# EAGLE design pcb (EAGLE 9.6.2)
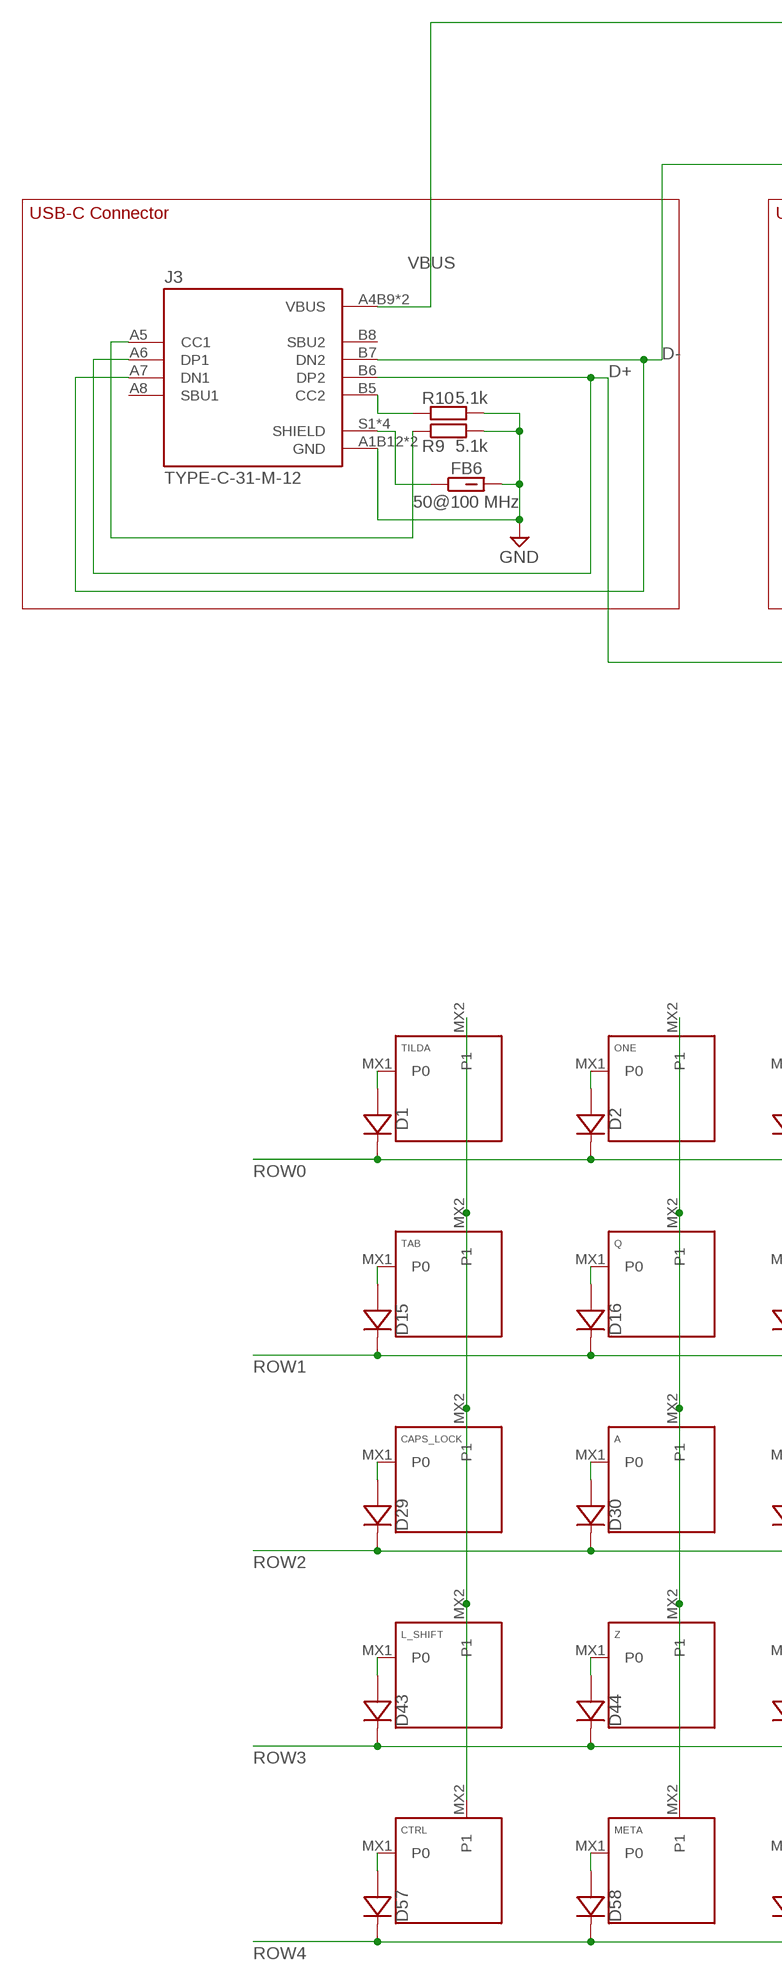
[diagram p0: schematic, sheet 1, part 1 of 2]
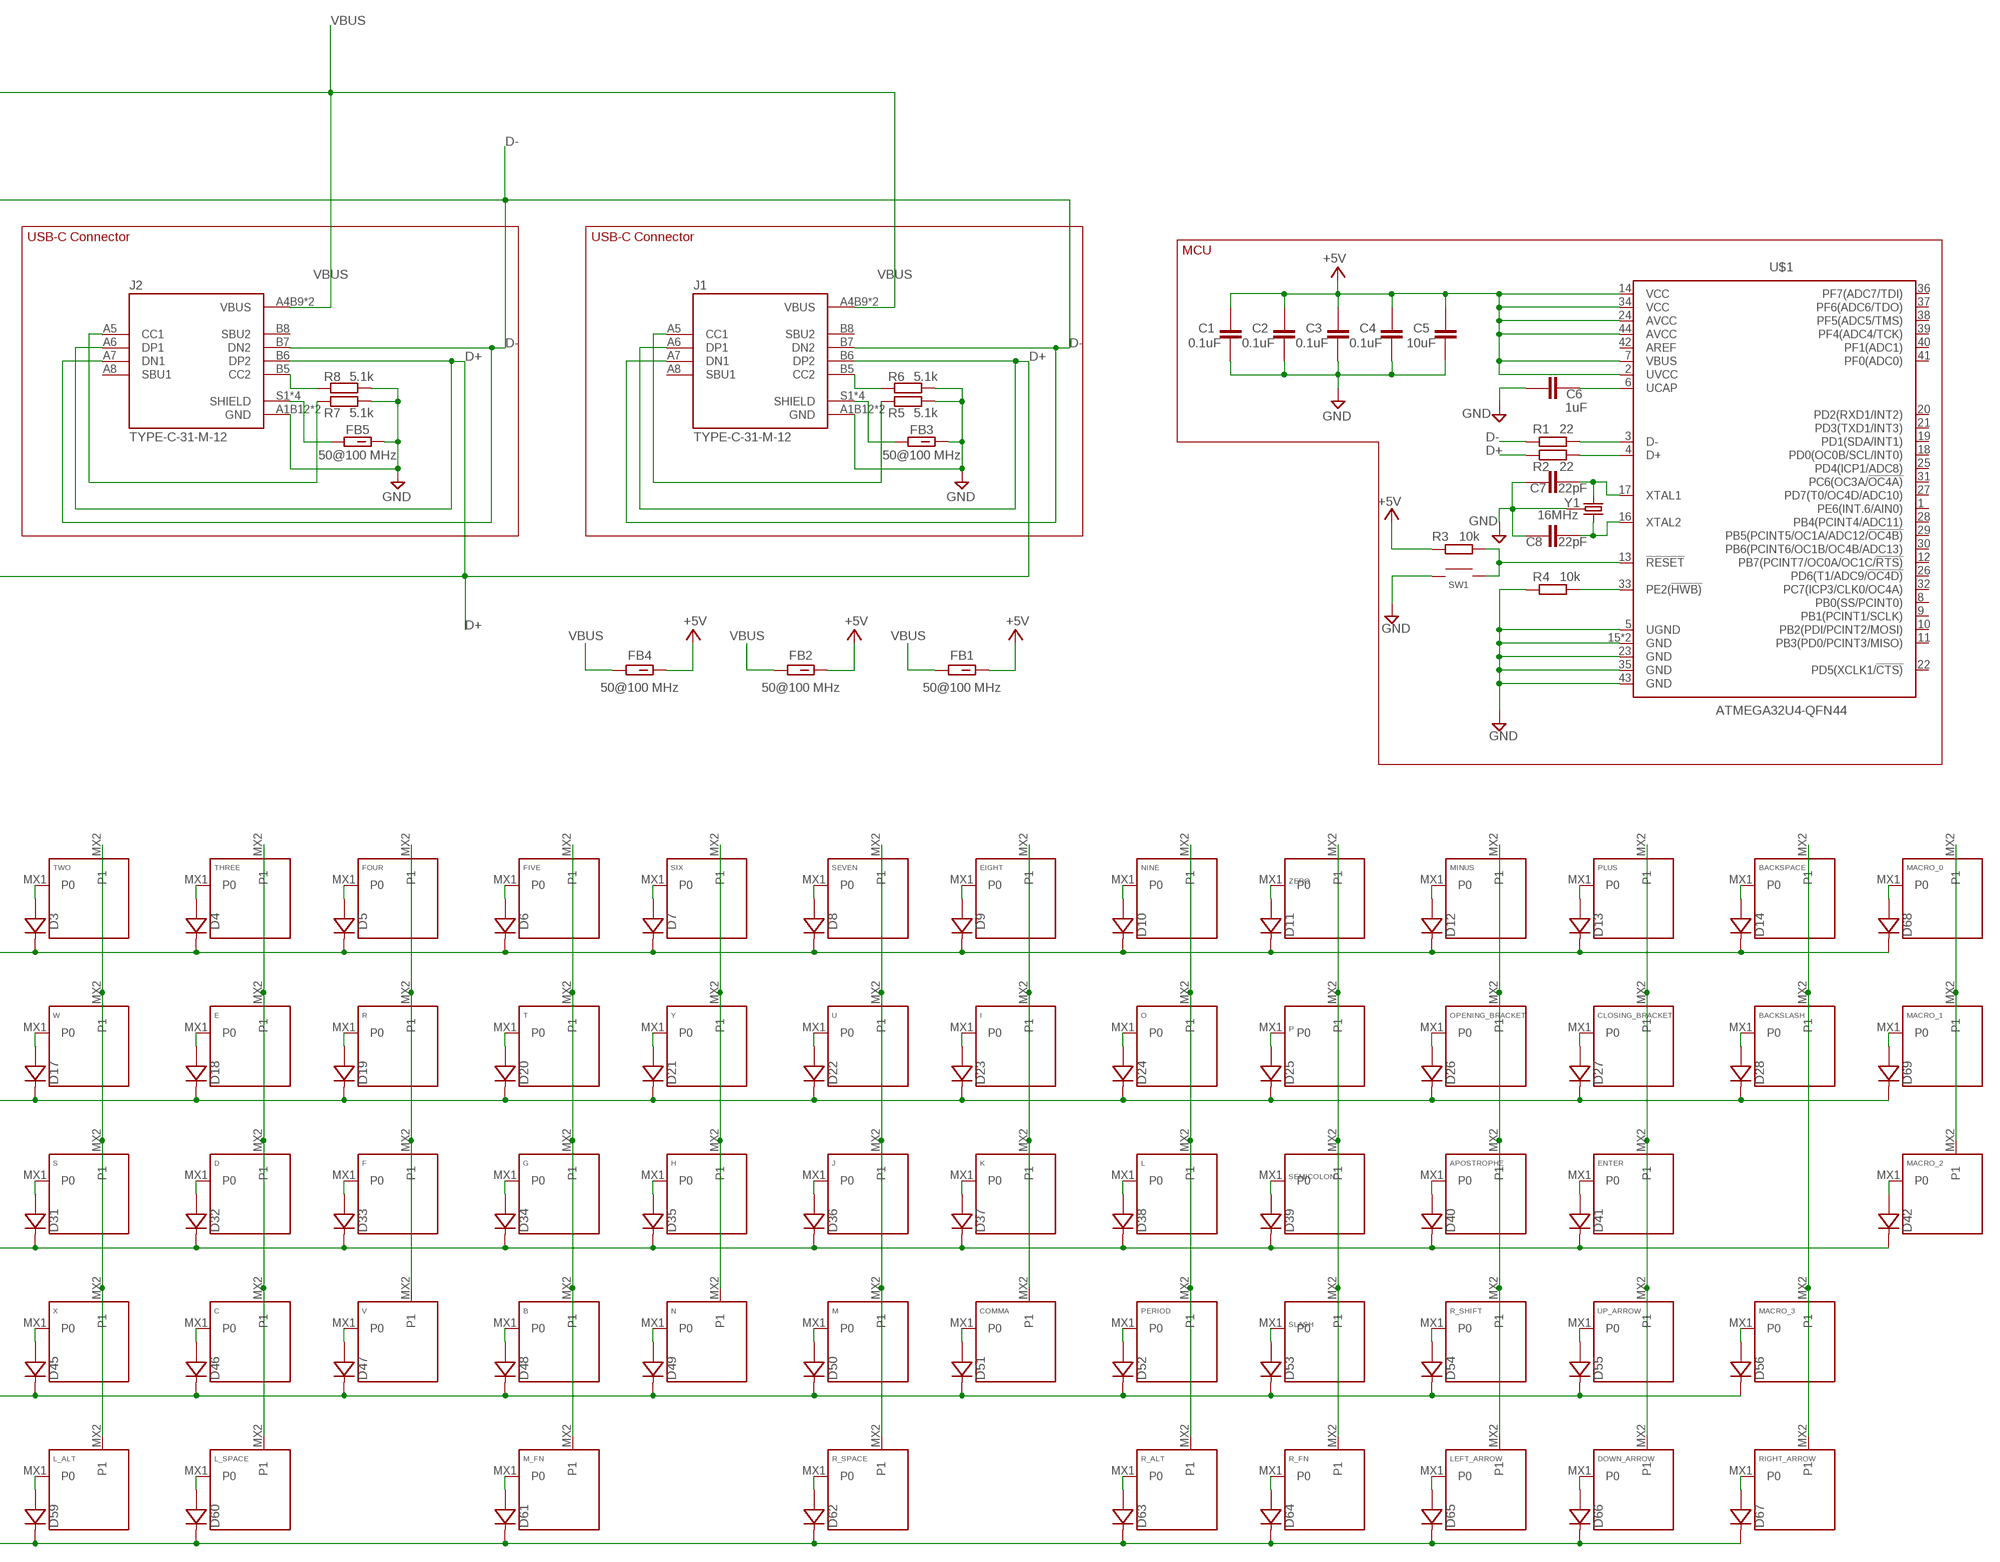
[diagram p1: schematic, sheet 1, part 2 of 2]

## Parts
A  KEYSWITCH-PLAIN-MXHSPCB-1U  [MXHSPCB-1U]
APOSTROPHE  KEYSWITCH-PLAIN-MXHSPCB-1U  [MXHSPCB-1U]
B  KEYSWITCH-PLAIN-MXHSPCB-1U  [MXHSPCB-1U]
BACKSLASH  KEYSWITCH-PLAIN-MXHSPCB-1U  [MXHSPCB-1U]
BACKSPACE  KEYSWITCH-PLAIN-MXHSPCB-2U  [MXHSPCB-2U]
C  KEYSWITCH-PLAIN-MXHSPCB-1U  [MXHSPCB-1U]
C1  0.1uF  CAPACITOR-0603  [C0603]
C2  0.1uF  CAPACITOR-0603  [C0603]
C3  0.1uF  CAPACITOR-0603  [C0603]
C4  0.1uF  CAPACITOR-0603  [C0603]
C5  10uF  CAPACITOR-0603  [C0603]
C6  1uF  CAPACITOR-0603  [C0603]
C7  22pF  CAPACITOR-0603  [C0603]
C8  22pF  CAPACITOR-0603  [C0603]
CAPS_LOCK  KEYSWITCH-PLAIN-MXHSPCB-1U  [MXHSPCB-1U]
CLOSING_BRACKET  KEYSWITCH-PLAIN-MXHSPCB-1U  [MXHSPCB-1U]
COMMA  KEYSWITCH-PLAIN-MXHSPCB-1U  [MXHSPCB-1U]
CTRL  KEYSWITCH-PLAIN-MXHSPCB-1U  [MXHSPCB-1U]
D  KEYSWITCH-PLAIN-MXHSPCB-1U  [MXHSPCB-1U]
D1  DIODE-SOD-123  [SOD-123]
D2  DIODE-SOD-123  [SOD-123]
D3  DIODE-SOD-123  [SOD-123]
D4  DIODE-SOD-123  [SOD-123]
D5  DIODE-SOD-123  [SOD-123]
D6  DIODE-SOD-123  [SOD-123]
D7  DIODE-SOD-123  [SOD-123]
D8  DIODE-SOD-123  [SOD-123]
D9  DIODE-SOD-123  [SOD-123]
D10  DIODE-SOD-123  [SOD-123]
D11  DIODE-SOD-123  [SOD-123]
D12  DIODE-SOD-123  [SOD-123]
D13  DIODE-SOD-123  [SOD-123]
D14  DIODE-SOD-123  [SOD-123]
D15  DIODE-SOD-123  [SOD-123]
D16  DIODE-SOD-123  [SOD-123]
D17  DIODE-SOD-123  [SOD-123]
D18  DIODE-SOD-123  [SOD-123]
D19  DIODE-SOD-123  [SOD-123]
D20  DIODE-SOD-123  [SOD-123]
D21  DIODE-SOD-123  [SOD-123]
D22  DIODE-SOD-123  [SOD-123]
D23  DIODE-SOD-123  [SOD-123]
D24  DIODE-SOD-123  [SOD-123]
D25  DIODE-SOD-123  [SOD-123]
D26  DIODE-SOD-123  [SOD-123]
D27  DIODE-SOD-123  [SOD-123]
D28  DIODE-SOD-123  [SOD-123]
D29  DIODE-SOD-123  [SOD-123]
D30  DIODE-SOD-123  [SOD-123]
D31  DIODE-SOD-123  [SOD-123]
D32  DIODE-SOD-123  [SOD-123]
D33  DIODE-SOD-123  [SOD-123]
D34  DIODE-SOD-123  [SOD-123]
D35  DIODE-SOD-123  [SOD-123]
D36  DIODE-SOD-123  [SOD-123]
D37  DIODE-SOD-123  [SOD-123]
D38  DIODE-SOD-123  [SOD-123]
D39  DIODE-SOD-123  [SOD-123]
D40  DIODE-SOD-123  [SOD-123]
D41  DIODE-SOD-123  [SOD-123]
D42  DIODE-SOD-123  [SOD-123]
D43  DIODE-SOD-123  [SOD-123]
D44  DIODE-SOD-123  [SOD-123]
D45  DIODE-SOD-123  [SOD-123]
D46  DIODE-SOD-123  [SOD-123]
D47  DIODE-SOD-123  [SOD-123]
D48  DIODE-SOD-123  [SOD-123]
D49  DIODE-SOD-123  [SOD-123]
D50  DIODE-SOD-123  [SOD-123]
D51  DIODE-SOD-123  [SOD-123]
D52  DIODE-SOD-123  [SOD-123]
D53  DIODE-SOD-123  [SOD-123]
D54  DIODE-SOD-123  [SOD-123]
D55  DIODE-SOD-123  [SOD-123]
D56  DIODE-SOD-123  [SOD-123]
D57  DIODE-SOD-123  [SOD-123]
D58  DIODE-SOD-123  [SOD-123]
D59  DIODE-SOD-123  [SOD-123]
D60  DIODE-SOD-123  [SOD-123]
D61  DIODE-SOD-123  [SOD-123]
D62  DIODE-SOD-123  [SOD-123]
D63  DIODE-SOD-123  [SOD-123]
D64  DIODE-SOD-123  [SOD-123]
D65  DIODE-SOD-123  [SOD-123]
D66  DIODE-SOD-123  [SOD-123]
D67  DIODE-SOD-123  [SOD-123]
D68  DIODE-SOD-123  [SOD-123]
D69  DIODE-SOD-123  [SOD-123]
DOWN_ARROW  KEYSWITCH-PLAIN-MXHSPCB-1U  [MXHSPCB-1U]
E  KEYSWITCH-PLAIN-MXHSPCB-1U  [MXHSPCB-1U]
EIGHT  KEYSWITCH-PLAIN-MXHSPCB-1U  [MXHSPCB-1U]
ENTER  KEYSWITCH-PLAIN-MXHSPCB-2U  [MXHSPCB-2U]
F  KEYSWITCH-PLAIN-MXHSPCB-1U  [MXHSPCB-1U]
FB1  50@100 MHz  FBCHIP-0603(1608-METRIC)  [BEADC1608X95N]
FB2  50@100 MHz  FBCHIP-0603(1608-METRIC)  [BEADC1608X95N]
FB3  50@100 MHz  FBCHIP-0603(1608-METRIC)  [BEADC1608X95N]
FB4  50@100 MHz  FBCHIP-0603(1608-METRIC)  [BEADC1608X95N]
FB5  50@100 MHz  FBCHIP-0603(1608-METRIC)  [BEADC1608X95N]
FB6  50@100 MHz  FBCHIP-0603(1608-METRIC)  [BEADC1608X95N]
FIVE  KEYSWITCH-PLAIN-MXHSPCB-1U  [MXHSPCB-1U]
FOUR  KEYSWITCH-PLAIN-MXHSPCB-1U  [MXHSPCB-1U]
G  KEYSWITCH-PLAIN-MXHSPCB-1U  [MXHSPCB-1U]
H  KEYSWITCH-PLAIN-MXHSPCB-1U  [MXHSPCB-1U]
I  KEYSWITCH-PLAIN-MXHSPCB-1U  [MXHSPCB-1U]
J  KEYSWITCH-PLAIN-MXHSPCB-1U  [MXHSPCB-1U]
J1  TYPE-C-31-M-12  [HRO_TYPE-C-31-M-12]
J2  TYPE-C-31-M-12  [HRO_TYPE-C-31-M-12]
J3  TYPE-C-31-M-12  [HRO_TYPE-C-31-M-12]
K  KEYSWITCH-PLAIN-MXHSPCB-1U  [MXHSPCB-1U]
L  KEYSWITCH-PLAIN-MXHSPCB-1U  [MXHSPCB-1U]
L_ALT  KEYSWITCH-PLAIN-MXHSPCB-1U  [MXHSPCB-1U]
L_SHIFT  KEYSWITCH-PLAIN-MXHSPCB-2U  [MXHSPCB-2U]
L_SPACE  KEYSWITCH-PLAIN-MXHSPCB-2U-FLIPPED  [MXHSPCB-2U-FLIPPED]
LEFT_ARROW  KEYSWITCH-PLAIN-MXHSPCB-1U  [MXHSPCB-1U]
M  KEYSWITCH-PLAIN-MXHSPCB-1U  [MXHSPCB-1U]
M_FN  KEYSWITCH-PLAIN-MXHSPCB-1U  [MXHSPCB-1U]
MACRO_0  KEYSWITCH-PLAIN-MXHSPCB-1U  [MXHSPCB-1U]
MACRO_1  KEYSWITCH-PLAIN-MXHSPCB-1U  [MXHSPCB-1U]
MACRO_2  KEYSWITCH-PLAIN-MXHSPCB-1U  [MXHSPCB-1U]
MACRO_3  KEYSWITCH-PLAIN-MXHSPCB-1U  [MXHSPCB-1U]
META  KEYSWITCH-PLAIN-MXHSPCB-1U  [MXHSPCB-1U]
MINUS  KEYSWITCH-PLAIN-MXHSPCB-1U  [MXHSPCB-1U]
N  KEYSWITCH-PLAIN-MXHSPCB-1U  [MXHSPCB-1U]
NINE  KEYSWITCH-PLAIN-MXHSPCB-1U  [MXHSPCB-1U]
O  KEYSWITCH-PLAIN-MXHSPCB-1U  [MXHSPCB-1U]
ONE  KEYSWITCH-PLAIN-MXHSPCB-1U  [MXHSPCB-1U]
OPENING_BRACKET  KEYSWITCH-PLAIN-MXHSPCB-1U  [MXHSPCB-1U]
P  KEYSWITCH-PLAIN-MXHSPCB-1U  [MXHSPCB-1U]
PERIOD  KEYSWITCH-PLAIN-MXHSPCB-1U  [MXHSPCB-1U]
PLUS  KEYSWITCH-PLAIN-MXHSPCB-1U  [MXHSPCB-1U]
Q  KEYSWITCH-PLAIN-MXHSPCB-1U  [MXHSPCB-1U]
R  KEYSWITCH-PLAIN-MXHSPCB-1U  [MXHSPCB-1U]
R1  22  RESISTOR-0603  [R0603]
R2  22  RESISTOR-0603  [R0603]
R3  10k  RESISTOR-0603  [R0603]
R4  10k  RESISTOR-0603  [R0603]
R5  5.1k  RESISTOR-0603  [R0603]
R6  5.1k  RESISTOR-0603  [R0603]
R7  5.1k  RESISTOR-0603  [R0603]
R8  5.1k  RESISTOR-0603  [R0603]
R9  5.1k  RESISTOR-0603  [R0603]
R10  5.1k  RESISTOR-0603  [R0603]
R_ALT  KEYSWITCH-PLAIN-MXHSPCB-1U  [MXHSPCB-1U]
R_FN  KEYSWITCH-PLAIN-MXHSPCB-1U  [MXHSPCB-1U]
R_SHIFT  KEYSWITCH-PLAIN-MXHSPCB-1U  [MXHSPCB-1U]
R_SPACE  KEYSWITCH-PLAIN-MXHSPCB-2U-FLIPPED  [MXHSPCB-2U-FLIPPED]
RIGHT_ARROW  KEYSWITCH-PLAIN-MXHSPCB-1U  [MXHSPCB-1U]
S  KEYSWITCH-PLAIN-MXHSPCB-1U  [MXHSPCB-1U]
SEMICOLON  KEYSWITCH-PLAIN-MXHSPCB-1U  [MXHSPCB-1U]
SEVEN  KEYSWITCH-PLAIN-MXHSPCB-1U  [MXHSPCB-1U]
SIX  KEYSWITCH-PLAIN-MXHSPCB-1U  [MXHSPCB-1U]
SLASH  KEYSWITCH-PLAIN-MXHSPCB-1U  [MXHSPCB-1U]
SW1  SWITCH-SMD-EVP-BB2A9B00  [SWITCH-SMD-EVP-BB2A9B00]
T  KEYSWITCH-PLAIN-MXHSPCB-1U  [MXHSPCB-1U]
TAB  KEYSWITCH-PLAIN-MXHSPCB-1U  [MXHSPCB-1U]
THREE  KEYSWITCH-PLAIN-MXHSPCB-1U  [MXHSPCB-1U]
TILDA  KEYSWITCH-PLAIN-MXHSPCB-1U  [MXHSPCB-1U]
TWO  KEYSWITCH-PLAIN-MXHSPCB-1U  [MXHSPCB-1U]
U  KEYSWITCH-PLAIN-MXHSPCB-1U  [MXHSPCB-1U]
U$1  ATMEGA32U4-QFN44  [QFN-44]
UP_ARROW  KEYSWITCH-PLAIN-MXHSPCB-1U  [MXHSPCB-1U]
V  KEYSWITCH-PLAIN-MXHSPCB-1U  [MXHSPCB-1U]
W  KEYSWITCH-PLAIN-MXHSPCB-1U  [MXHSPCB-1U]
X  KEYSWITCH-PLAIN-MXHSPCB-1U  [MXHSPCB-1U]
Y  KEYSWITCH-PLAIN-MXHSPCB-1U  [MXHSPCB-1U]
Y1  16MHz  CRYSTAL-16MHZ_SMALL  [CRYSTAL-SMD-2X2.5MM]
Z  KEYSWITCH-PLAIN-MXHSPCB-1U  [MXHSPCB-1U]
ZERO  KEYSWITCH-PLAIN-MXHSPCB-1U  [MXHSPCB-1U]

## Nets
+5V: FB1.2 FB2.2 FB4.2
D+: J1.A6(DP1) J1.B6(DP2) J2.A6(DP1) J2.B6(DP2) J3.A6(DP1) J3.B6(DP2) R2.1
D-: J1.A7(DN1) J1.B7(DN2) J2.A7(DN1) J2.B7(DN2) J3.A7(DN1) J3.B7(DN2) R1.1
GND: C1.1 C2.1 C3.1 C4.1 C5.1 C6.1 C7.1 C8.1 FB3.2 FB5.2 FB6.2 J1.A1B12(GND) J1.B1A12(GND) J2.A1B12(GND) J2.B1A12(GND) J3.A1B12(GND) J3.B1A12(GND) R4.1 R5.2 R6.2 R7.2 R8.2 R9.2 R10.2 SW1.A@1 SW1.A@2 U$1.5(UGND) U$1.15(GND) U$1.23(GND) U$1.35(GND) U$1.43(GND) U$1.TAB(GND) Y1.P2(GND) Y1.P4(GND)
N$1: D1.A TILDA.MX1(P0)
N$2: D2.A ONE.MX1(P0)
N$3: D3.A TWO.MX1(P0)
N$4: D4.A THREE.MX1(P0)
N$5: D5.A FOUR.MX1(P0)
N$6: D6.A FIVE.MX1(P0)
N$7: D7.A SIX.MX1(P0)
N$8: D8.A SEVEN.MX1(P0)
N$9: D9.A EIGHT.MX1(P0)
N$10: D10.A NINE.MX1(P0)
N$11: D11.A ZERO.MX1(P0)
N$12: D12.A MINUS.MX1(P0)
N$13: D13.A PLUS.MX1(P0)
N$14: BACKSPACE.MX1(P0) D14.A
N$15: D15.A TAB.MX1(P0)
N$16: D16.A Q.MX1(P0)
N$17: D17.A W.MX1(P0)
N$18: D18.A E.MX1(P0)
N$19: D19.A R.MX1(P0)
N$20: D20.A T.MX1(P0)
N$21: D21.A Y.MX1(P0)
N$22: D22.A U.MX1(P0)
N$23: D23.A I.MX1(P0)
N$24: D24.A O.MX1(P0)
N$25: D25.A P.MX1(P0)
N$26: D26.A OPENING_BRACKET.MX1(P0)
N$27: CLOSING_BRACKET.MX1(P0) D27.A
N$28: BACKSLASH.MX1(P0) D28.A
N$29: CAPS_LOCK.MX1(P0) D29.A
N$30: A.MX1(P0) D30.A
N$31: D31.A S.MX1(P0)
N$32: D32.A D.MX1(P0)
N$33: D33.A F.MX1(P0)
N$34: D34.A G.MX1(P0)
N$35: D35.A H.MX1(P0)
N$36: D36.A J.MX1(P0)
N$37: D37.A K.MX1(P0)
N$38: D38.A L.MX1(P0)
N$39: D39.A SEMICOLON.MX1(P0)
N$40: APOSTROPHE.MX1(P0) D40.A
N$41: D41.A ENTER.MX1(P0)
N$42: D42.A MACRO_2.MX1(P0)
N$43: D43.A L_SHIFT.MX1(P0)
N$44: D44.A Z.MX1(P0)
N$45: D45.A X.MX1(P0)
N$46: C.MX1(P0) D46.A
N$47: D47.A V.MX1(P0)
N$48: B.MX1(P0) D48.A
N$49: D49.A N.MX1(P0)
N$50: D50.A M.MX1(P0)
N$51: COMMA.MX1(P0) D51.A
N$52: D52.A PERIOD.MX1(P0)
N$53: D53.A SLASH.MX1(P0)
N$54: D54.A R_SHIFT.MX1(P0)
N$55: D55.A UP_ARROW.MX1(P0)
N$56: D56.A MACRO_3.MX1(P0)
N$57: CTRL.MX1(P0) D57.A
N$58: D58.A META.MX1(P0)
N$59: D59.A L_ALT.MX1(P0)
N$60: D60.A L_SPACE.MX1(P0)
N$61: D62.A R_SPACE.MX1(P0)
N$62: D63.A R_ALT.MX1(P0)
N$63: D65.A LEFT_ARROW.MX1(P0)
N$64: D67.A RIGHT_ARROW.MX1(P0)
N$65: D69.A MACRO_1.MX1(P0)
N$66: D68.A MACRO_0.MX1(P0)
N$67: D61.A M_FN.MX1(P0)
N$68: D66.A DOWN_ARROW.MX1(P0)
N$69: D64.A R_FN.MX1(P0)
N$70: CAPS_LOCK.MX2(P1) CTRL.MX2(P1) L_SHIFT.MX2(P1) TAB.MX2(P1) TILDA.MX2(P1)
N$71: A.MX2(P1) META.MX2(P1) ONE.MX2(P1) Q.MX2(P1) Z.MX2(P1)
N$72: L_ALT.MX2(P1) S.MX2(P1) TWO.MX2(P1) W.MX2(P1) X.MX2(P1)
N$73: C.MX2(P1) D.MX2(P1) E.MX2(P1) L_SPACE.MX2(P1) THREE.MX2(P1)
N$74: F.MX2(P1) FOUR.MX2(P1) R.MX2(P1) V.MX2(P1)
N$75: B.MX2(P1) FIVE.MX2(P1) G.MX2(P1) M_FN.MX2(P1) T.MX2(P1)
N$76: H.MX2(P1) N.MX2(P1) SIX.MX2(P1) Y.MX2(P1)
N$77: J.MX2(P1) M.MX2(P1) R_SPACE.MX2(P1) SEVEN.MX2(P1) U.MX2(P1)
N$78: COMMA.MX2(P1) EIGHT.MX2(P1) I.MX2(P1) K.MX2(P1)
N$79: L.MX2(P1) NINE.MX2(P1) O.MX2(P1) PERIOD.MX2(P1) R_ALT.MX2(P1)
N$80: APOSTROPHE.MX2(P1) LEFT_ARROW.MX2(P1) MINUS.MX2(P1) OPENING_BRACKET.MX2(P1) R_SHIFT.MX2(P1)
N$81: P.MX2(P1) R_FN.MX2(P1) SEMICOLON.MX2(P1) SLASH.MX2(P1) ZERO.MX2(P1)
N$82: CLOSING_BRACKET.MX2(P1) DOWN_ARROW.MX2(P1) ENTER.MX2(P1) PLUS.MX2(P1) UP_ARROW.MX2(P1)
N$83: BACKSLASH.MX2(P1) BACKSPACE.MX2(P1) MACRO_3.MX2(P1) RIGHT_ARROW.MX2(P1)
N$84: MACRO_0.MX2(P1) MACRO_1.MX2(P1) MACRO_2.MX2(P1)
N$85: R4.2 U$1.33(PE2(!HWB))
N$86: R3.2 SW1.B@3 SW1.B@4 U$1.13(!RESET)
N$87: C7.2 U$1.17(XTAL1) Y1.P1
N$88: C8.2 U$1.16(XTAL2) Y1.P3
N$89: R2.2 U$1.4(D+)
N$90: R1.2 U$1.3(D-)
N$91: C6.2 U$1.6(UCAP)
N$92: J2.A5(CC1) R7.1
N$93: J1.A5(CC1) R5.1
N$94: J1.B5(CC2) R6.1
N$95: J2.B5(CC2) R8.1
N$96: FB5.1 J2.S1(SHIELD) J2.S2(SHIELD) J2.S3(SHIELD) J2.S4(SHIELD)
N$97: J3.A5(CC1) R9.1
N$98: FB3.1 J1.S1(SHIELD) J1.S2(SHIELD) J1.S3(SHIELD) J1.S4(SHIELD)
N$99: J3.B5(CC2) R10.1
N$100: FB6.1 J3.S1(SHIELD) J3.S2(SHIELD) J3.S3(SHIELD) J3.S4(SHIELD)
ROW0: D1.C D2.C D3.C D4.C D5.C D6.C D7.C D8.C D9.C D10.C D11.C D12.C D13.C D14.C D68.C
ROW1: D15.C D16.C D17.C D18.C D19.C D20.C D21.C D22.C D23.C D24.C D25.C D26.C D27.C D28.C D69.C
ROW2: D29.C D30.C D31.C D32.C D33.C D34.C D35.C D36.C D37.C D38.C D39.C D40.C D41.C D42.C
ROW3: D43.C D44.C D45.C D46.C D47.C D48.C D49.C D50.C D51.C D52.C D53.C D54.C D55.C D56.C
ROW4: D57.C D58.C D59.C D60.C D61.C D62.C D63.C D64.C D65.C D66.C D67.C
VBUS: FB1.1 FB2.1 FB4.1 J1.A4B9(VBUS) J1.B4A9(VBUS) J2.A4B9(VBUS) J2.B4A9(VBUS) J3.A4B9(VBUS) J3.B4A9(VBUS)
VCC: C1.2 C2.2 C3.2 C4.2 C5.2 R3.1 U$1.2(UVCC) U$1.7(VBUS) U$1.14(VCC) U$1.24(AVCC) U$1.34(VCC) U$1.44(AVCC) ; supply symbol labelled +5V
Unconnected: J1.A8(SBU1) J1.B8(SBU2) J2.A8(SBU1) J2.B8(SBU2) J3.A8(SBU1) J3.B8(SBU2) U$1.1(PE6(INT.6/AIN0)) U$1.8(PB0(SS/PCINT0)) U$1.9(PB1(PCINT1/SCLK)) U$1.10(PB2(PDI/PCINT2/MOSI)) U$1.11(PB3(PD0/PCINT3/MISO)) U$1.12(PB7(PCINT7/OC0A/OC1C/!RTS)) U$1.18(PD0(OC0B/SCL/INT0)) U$1.19(PD1(SDA/INT1)) U$1.20(PD2(RXD1/INT2)) U$1.21(PD3(TXD1/INT3)) U$1.22(PD5(XCLK1/!CTS)) U$1.25(PD4(ICP1/ADC8)) U$1.26(PD6(T1/ADC9/!OC4D)) U$1.27(PD7(T0/OC4D/ADC10)) U$1.28(PB4(PCINT4/ADC11)) U$1.29(PB5(PCINT5/OC1A/ADC12/!OC4B)) U$1.30(PB6(PCINT6/OC1B/OC4B/ADC13)) U$1.31(PC6(OC3A/!OC4A)) U$1.32(PC7(ICP3/CLK0/OC4A)) U$1.36(PF7(ADC7/TDI)) U$1.37(PF6(ADC6/TDO)) U$1.38(PF5(ADC5/TMS)) U$1.39(PF4(ADC4/TCK)) U$1.40(PF1(ADC1)) U$1.41(PF0(ADC0)) U$1.42(AREF)

## Notes on the sheet
- USB-C Connector | USB-C Connector | USB-C Connector
- MCU

## Library data of the parts
A APOSTROPHE B BACKSLASH BACKSPACE C CAPS_LOCK CLOSING_BRACKET COMMA CTRL D DOWN_ARROW E EIGHT ENTER F FIVE FOUR G H I J K L L_ALT L_SHIFT L_SPACE LEFT_ARROW M M_FN MACRO_0 MACRO_1-MACRO_3 META MINUS N NINE O ONE OPENING_BRACKET P PERIOD PLUS Q R R_ALT R_FN R_SHIFT R_SPACE RIGHT_ARROW S SEMICOLON SEVEN SIX SLASH T TAB THREE TILDA TWO U UP_ARROW V W X Y Z ZERO = Keyboard:KEYSWITCH-PLAIN
C1-C8 = Components:CAPACITOR
D1-D69 = Components:DIODE: Standard 1N4148 diode
FB1-FB6 = Filter:FB: Ferrite Bead - Generic; CATEGORY: Filter; SUB-CATEGORY: Ferrite bead; VALUE: FERRITE_BEAD
J1-J3 = TYPE-C-31-M-12:TYPE-C-31-M-12: USB Connectors 24 Receptacle 1 8.94*7.3mm RoHS; AVAILABILITY: Unavailable; DESCRIPTION: USB Connectors 24 Receptacle 1 8.94*7.3mm RoHS; MF: HRO Electronics Co., Ltd.; MP: TYPE-C-31-M-12; PACKAGE: Package; PRICE: None
R1-R10 = Components:RESISTOR
SW1 = Controller:SWITCH-SMD
U$1 = MCU:ATMEGA32U4
Y1 = SparkFun-Clocks:CRYSTAL-16MHZ_SMALL: 16 MHz Crystal Digikey Link <https://www.digikey.com/product-detail/en/epson/FA-20H-16.0000MF10Z-AJ5/SER4201TR-ND/7430936> Crystal Attributes: Frequency: 16 MHz Frequency Stability: +/- 10ppm Frequency Tolerance: +/- 10ppm Load Capacitance: 8pF ESR: 80 Ohms Operating Mode: Fundamental PAD 2 and PAD 4 are GROUNDED; PROD_ID: XTAL-14664

## Board
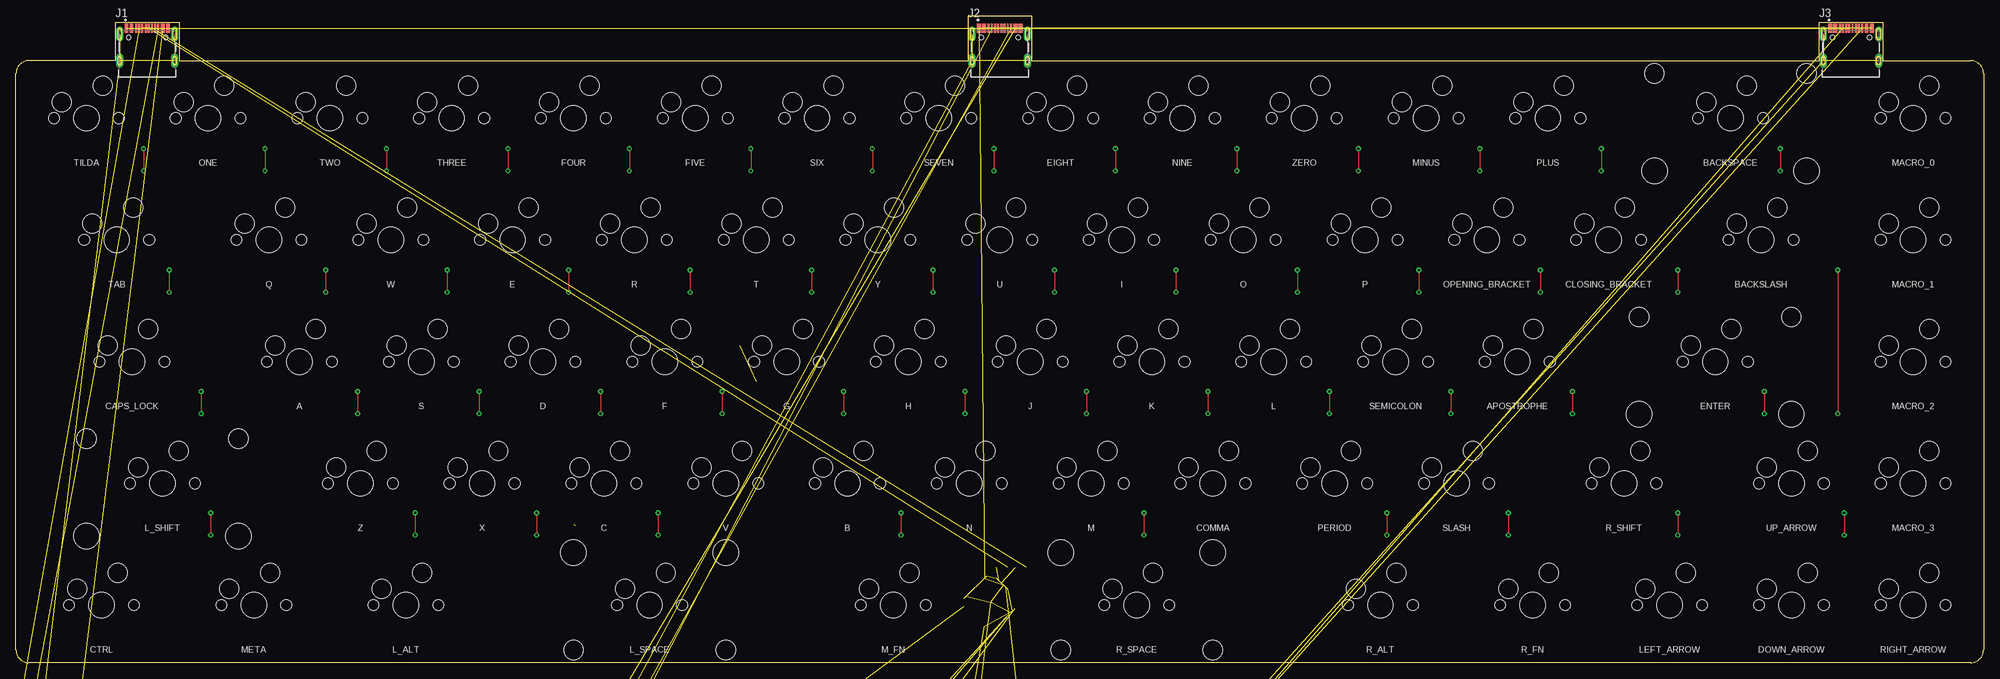
[diagram p2: board, top side]
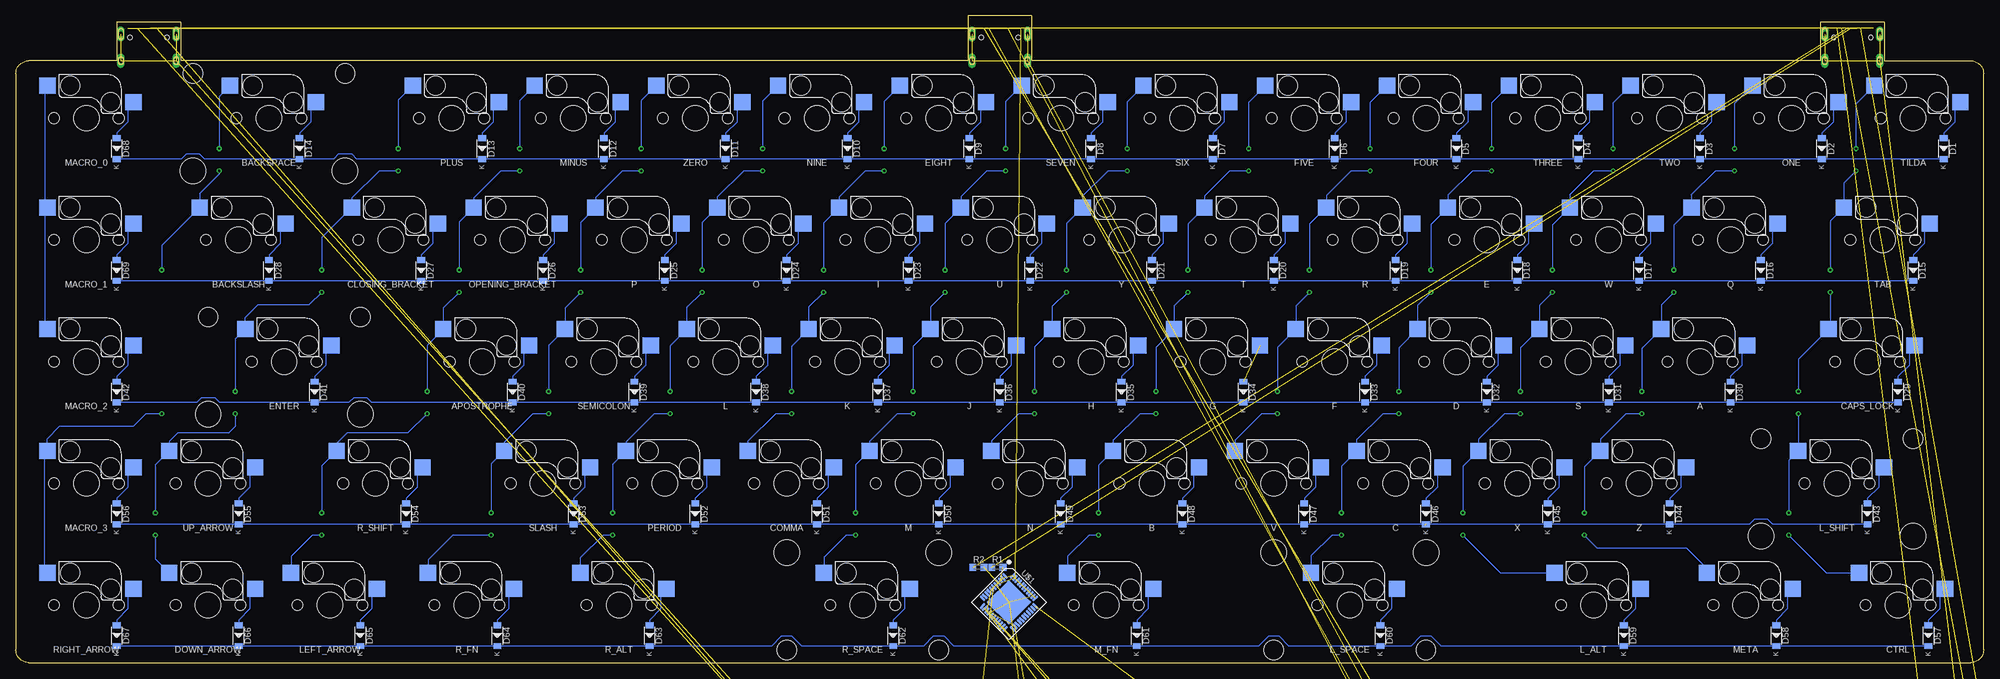
[diagram p3: board, bottom side, seen from below]

Size 307.75 x 101.2 mm. Coordinates in mm from the lower left corner, seen from the top.
Outline: 307.75,92.2 307.75,2 arc-90 305.75,0 2,0 arc-90 0,2 0,92.2 arc-90 2,94.2 15.52,94.2 15.52,100.2 25.53,100.2 25.53,94.2 148.88,94.2 148.88,101.2 158.88,101.2 158.88,94.2 282.01,94.2 282.01,100.2 292.01,100.2 292.01,94.2 305.75,94.2 arc-90 307.75,92.2
Copper layers (1*16): Top 0.035mm / dielectric 1.5mm / Bottom 0.035mm
Design rules "default *": minimum track width 6mil, minimum drill 0.35mm, track to track 6mil, track to pad 6mil, pad to pad 6mil, via to via 6mil, smd to smd 6mil, copper to edge 20mil, drill to drill 6mil, minimum pad ring 10mil, minimum via ring 8mil, stop-mask expansion 4mil, vias tented up to drill 0mil, thermal gap 10mil

### Footprints (pad centres in the part's own frame; a part is rotated, then mirrored left to right if it is on the bottom)
MXHSPCB-1U = smd 2.55 x 2.5: MX1 7.36,2.54; MX2 -6.09,5.08 | hole 4: 0,0 | hole 1.7: 5.08,0; -5.08,0 | hole 3: 3.81,2.54; -2.54,5.08
MXHSPCB-2U = smd 2.55 x 2.5: MX1 7.36,2.54; MX2 -6.09,5.08 | hole 4: 0,0; -11.9,-8.24; 11.9,-8.24 | hole 1.7: 5.08,0; -5.08,0 | hole 3: 3.81,2.54; -2.54,5.08 | hole 3.05: -11.9,7; 11.9,7
C0603 = smd 1.05 x 1.08: 1 -0.875,0; 2 0.875,0
SOD-123 = smd 0.91 x 1.22: A -1.635,0; C 1.635,0
BEADC1608X95N = smd 0.9 x 0.97: 1 -0.785,0 | smd 0.933 x 0.97: 2 0.769,0
HRO_TYPE-C-31-M-12 = smd 0.6 x 1.45: A1B12 -3.25,5.095; A4B9 -2.45,5.095; B1A12 3.25,5.095; B4A9 2.45,5.095 | smd 0.3 x 1.45: A5 -1.25,5.095; A6 -0.25,5.095; A7 0.25,5.095; A8 1.25,5.095; B5 1.75,5.095; B6 0.75,5.095; B7 -0.75,5.095; B8 -1.75,5.095 | drill 0.65 pad 1.05 long: S1 -4.32,4.18; S2 4.32,4.18; S3 -4.32,0; S4 4.32,0 | hole 0.7: -2.89,3.65; 2.89,3.65
MXHSPCB-2U-FLIPPED = smd 2.55 x 2.5: MX1 7.36,2.54; MX2 -6.09,5.08 | hole 4: 0,0; -11.9,8.24; 11.9,8.24 | hole 1.7: 5.08,0; -5.08,0 | hole 3: 3.81,2.54; -2.54,5.08 | hole 3.05: -11.9,-7; 11.9,-7
R0603 = smd 1.05 x 1.08: 1 -0.875,0; 2 0.875,0
SWITCH-SMD-EVP-BB2A9B00 = smd 0.95 x 0.55: A@1 -1.6,0.6; A@2 -1.6,-0.6; B@3 1.6,0.6; B@4 1.6,-0.6
QFN-44 = smd 1 x 0.3: 1 -3.35,2.5; 2 -3.35,2; 3 -3.35,1.5; 4 -3.35,1; 5 -3.35,0.5; 6 -3.35,0; 7 -3.35,-0.5; 8 -3.35,-1; 9 -3.35,-1.5; 10 -3.35,-2; 11 -3.35,-2.5; 23 3.35,-2.5; 24 3.35,-2; 25 3.35,-1.5; 26 3.35,-1; 27 3.35,-0.5; 28 3.35,0; 29 3.35,0.5; 30 3.35,1; 31 3.35,1.5; 32 3.35,2; 33 3.35,2.5 | smd 0.3 x 1: 12 -2.5,-3.35; 13 -2,-3.35; 14 -1.5,-3.35; 15 -1,-3.35; 16 -0.5,-3.35; 17 0,-3.35; 18 0.5,-3.35; 19 1,-3.35; 20 1.5,-3.35; 21 2,-3.35; 22 2.5,-3.35; 34 2.5,3.35; 35 2,3.35; 36 1.5,3.35; 37 1,3.35; 38 0.5,3.35; 39 0,3.35; 40 -0.5,3.35; 41 -1,3.35; 42 -1.5,3.35; 43 -2,3.35; 44 -2.5,3.35 | smd 5.08 x 5.08: TAB 0,0
CRYSTAL-SMD-2X2.5MM = smd 1.2 x 1.1: P1 0.846,0.69; P2 -0.854,0.69; P3 -0.854,-0.71; P4 0.846,-0.71

### Placement (x,y rotation side)
A  44.34,47.1 0 bottom
APOSTROPHE  234.84,47.1 0 bottom
B  130.06,28.05 0 bottom
BACKSLASH  272.94,66.15 0 bottom
BACKSPACE  268.18,85.2 0 bottom
C  91.96,28.05 0 bottom
C1  148.45,-17.05 0 bottom  (outside the outline)
C2  147.45,-31.55 0 bottom  (outside the outline)
C3  140.95,-43.05 0 bottom  (outside the outline)
C4  136.45,-62.05 0 bottom  (outside the outline)
C5  129.95,-76.55 0 bottom  (outside the outline)
C6  168.45,-103.55 0 bottom  (outside the outline)
C7  103.95,-118.05 0 bottom  (outside the outline)
C8  77.95,-119.55 0 bottom  (outside the outline)
CAPS_LOCK  18.14,47.1 0 bottom
CLOSING_BRACKET  249.12,66.15 0 bottom
COMMA  187.21,28.05 0 bottom
CTRL  13.38,9 0 bottom
D  82.44,47.1 0 bottom
D1  6.24,80.44 270 bottom
D2  25.29,80.44 270 bottom
D3  44.34,80.44 270 bottom
D4  63.39,80.44 270 bottom
D5  82.44,80.44 270 bottom
D6  101.49,80.44 270 bottom
D7  120.54,80.44 270 bottom
D8  139.59,80.44 270 bottom
D9  158.64,80.44 270 bottom
D10  177.69,80.44 270 bottom
D11  196.74,80.44 270 bottom
D12  215.79,80.44 270 bottom
D13  234.84,80.44 270 bottom
D14  263.41,80.44 270 bottom
D15  11,61.39 270 bottom
D16  34.81,61.39 270 bottom
D17  53.86,61.39 270 bottom
D18  72.91,61.39 270 bottom
D19  91.96,61.39 270 bottom
D20  111.01,61.39 270 bottom
D21  130.06,61.39 270 bottom
D22  149.11,61.39 270 bottom
D23  168.16,61.39 270 bottom
D24  187.21,61.39 270 bottom
D25  206.26,61.39 270 bottom
D26  225.31,61.39 270 bottom
D27  244.36,61.39 270 bottom
D28  268.18,61.39 270 bottom
D29  13.38,42.34 270 bottom
D30  39.58,42.34 270 bottom
D31  58.62,42.34 270 bottom
D32  77.67,42.34 270 bottom
D33  96.73,42.34 270 bottom
D34  115.78,42.34 270 bottom
D35  134.82,42.34 270 bottom
D36  153.88,42.34 270 bottom
D37  172.92,42.34 270 bottom
D38  191.97,42.34 270 bottom
D39  211.02,42.34 270 bottom
D40  230.07,42.34 270 bottom
D41  261.03,42.34 270 bottom
D42  291.99,42.34 270 bottom
D43  18.14,23.29 270 bottom
D44  49.1,23.29 270 bottom
D45  68.15,23.29 270 bottom
D46  87.2,23.29 270 bottom
D47  106.25,23.29 270 bottom
D48  125.3,23.29 270 bottom
D49  144.35,23.29 270 bottom
D50  163.4,23.29 270 bottom
D51  182.45,23.29 270 bottom
D52  201.5,23.29 270 bottom
D53  220.55,23.29 270 bottom
D54  246.74,23.29 270 bottom
D55  272.94,23.29 270 bottom
D56  291.99,23.29 270 bottom
D57  8.62,4.24 270 bottom
D58  32.43,4.24 270 bottom
D59  56.24,4.24 270 bottom
D60  94.34,4.24 270 bottom
D61  132.44,4.24 270 bottom
D62  170.54,4.24 270 bottom
D63  208.64,4.24 270 bottom
D64  232.46,4.24 270 bottom
D65  253.89,4.24 270 bottom
D66  272.94,4.24 270 bottom
D67  291.99,4.24 270 bottom
D68  291.99,80.44 270 bottom
D69  291.99,61.39 270 bottom
DOWN_ARROW  277.7,9 0 bottom
E  77.67,66.15 0 bottom
EIGHT  163.4,85.2 0 bottom
ENTER  265.79,47.1 0 bottom
F  101.49,47.1 0 bottom
FB1  -4.05,-125.05 0 top  (outside the outline)
FB2  -14.55,-184.05 0 top  (outside the outline)
FB3  -18.05,-197.05 0 top  (outside the outline)
FB4  -14.55,-190.55 0 top  (outside the outline)
FB5  -18.05,-217.55 0 top  (outside the outline)
FB6  -18.05,-242.55 0 top  (outside the outline)
FIVE  106.25,85.2 0 bottom
FOUR  87.2,85.2 0 bottom
G  120.54,47.1 0 bottom
H  139.59,47.1 0 bottom
I  172.92,66.15 0 bottom
J  158.64,47.1 0 bottom
J1  20.52,94.2 0 top
J2  153.88,94.2 0 top
J3  287.01,94.2 0 top
K  177.69,47.1 0 bottom
L  196.74,47.1 0 bottom
L_ALT  61.01,9 0 bottom
L_SHIFT  22.91,28.05 0 bottom
L_SPACE  99.11,9 0 bottom
LEFT_ARROW  258.65,9 0 bottom
M  168.16,28.05 0 bottom
M_FN  137.21,9 0 bottom
MACRO_0  296.75,85.2 0 bottom
MACRO_1  296.75,66.15 0 bottom
MACRO_2  296.75,47.1 0 bottom
MACRO_3  296.75,28.05 0 bottom
META  37.19,9 0 bottom
MINUS  220.55,85.2 0 bottom
N  149.11,28.05 0 bottom
NINE  182.45,85.2 0 bottom
O  191.97,66.15 0 bottom
ONE  30.05,85.2 0 bottom
OPENING_BRACKET  230.07,66.15 0 bottom
P  211.02,66.15 0 bottom
PERIOD  206.26,28.05 0 bottom
PLUS  239.6,85.2 0 bottom
Q  39.58,66.15 0 bottom
R  96.73,66.15 0 bottom
R1  154.25,14.94 0 bottom
R2  157.21,14.94 0 bottom
R3  99.45,-70.05 0 bottom  (outside the outline)
R4  19.95,-86.55 0 bottom  (outside the outline)
R5  -20.55,-130.55 0 top  (outside the outline)
R6  -20.55,-135.05 0 top  (outside the outline)
R7  -10.55,-216.55 0 top  (outside the outline)
R8  -22.05,-223.05 0 top  (outside the outline)
R9  -10.55,-241.55 0 top  (outside the outline)
R10  -22.05,-248.05 0 top  (outside the outline)
R_ALT  213.41,9 0 bottom
R_FN  237.22,9 0 bottom
R_SHIFT  251.51,28.05 0 bottom
R_SPACE  175.31,9 0 bottom
RIGHT_ARROW  296.75,9 0 bottom
S  63.39,47.1 0 bottom
SEMICOLON  215.79,47.1 0 bottom
SEVEN  144.35,85.2 0 bottom
SIX  125.3,85.2 0 bottom
SLASH  225.31,28.05 0 bottom
SW1  41.62,-26.97 0 bottom  (outside the outline)
T  115.78,66.15 0 bottom
TAB  15.76,66.15 0 bottom
THREE  68.15,85.2 0 bottom
TILDA  11,85.2 0 bottom
TWO  49.1,85.2 0 bottom
U  153.88,66.15 0 bottom
U$1  152.45,9.45 315 bottom
UP_ARROW  277.7,28.05 0 bottom
V  111.01,28.05 0 bottom
W  58.62,66.15 0 bottom
X  72.91,28.05 0 bottom
Y  134.82,66.15 0 bottom
Y1  100.95,-54.05 0 bottom  (outside the outline)
Z  53.86,28.05 0 bottom
ZERO  201.5,85.2 0 bottom

### Tracks (layer width: path | path; a pad name or v marks a point on that pad's centre or on a via)
+5V  (2 unrouted)
D+  (6 unrouted)
D-  (6 unrouted)
GND  (33 unrouted)
N$1
  Bottom 0.152: TILDA.MX1 4.49,86.89 4.49,84.61 6.24,82.85 D1.A
N$2
  Bottom 0.152: ONE.MX1 23.54,86.89 23.54,84.61 25.29,82.85 D2.A
N$3
  Bottom 0.152: TWO.MX1 42.59,86.89 42.59,84.61 44.34,82.85 D3.A
N$4
  Bottom 0.152: THREE.MX1 61.64,86.89 61.64,84.61 63.39,82.85 D4.A
N$5
  Bottom 0.152: FOUR.MX1 80.69,86.89 80.69,84.61 82.44,82.85 D5.A
N$6
  Bottom 0.152: FIVE.MX1 99.74,86.89 99.74,84.61 101.49,82.85 D6.A
N$7
  Bottom 0.152: SIX.MX1 118.79,86.89 118.79,84.61 120.54,82.85 D7.A
N$8
  Bottom 0.152: SEVEN.MX1 137.84,86.89 137.84,84.61 139.59,82.85 D8.A
N$9
  Bottom 0.152: EIGHT.MX1 156.89,86.89 156.89,84.61 158.64,82.85 D9.A
N$10
  Bottom 0.152: NINE.MX1 175.94,86.89 175.94,84.61 177.69,82.85 D10.A
N$11
  Bottom 0.152: ZERO.MX1 194.99,86.89 194.99,84.61 196.74,82.85 D11.A
N$12
  Bottom 0.152: MINUS.MX1 214.04,86.89 214.04,84.61 215.79,82.85 D12.A
N$13
  Bottom 0.152: PLUS.MX1 233.09,86.89 233.09,84.61 234.84,82.85 D13.A
N$14
  Bottom 0.152: BACKSPACE.MX1 261.66,86.89 261.66,84.61 263.41,82.86 D14.A
N$15
  Bottom 0.152: TAB.MX1 9.25,67.84 9.25,65.56 11,63.8 D15.A
N$16
  Bottom 0.152: Q.MX1 33.06,67.84 33.06,65.56 34.81,63.8 D16.A
N$17
  Bottom 0.152: W.MX1 52.11,67.84 52.11,65.56 53.86,63.8 D17.A
N$18
  Bottom 0.152: E.MX1 71.16,67.84 71.16,65.56 72.91,63.8 D18.A
N$19
  Bottom 0.152: R.MX1 90.21,67.84 90.21,65.56 91.96,63.8 D19.A
N$20
  Bottom 0.152: T.MX1 109.26,67.84 109.26,65.56 111.01,63.8 D20.A
N$21
  Bottom 0.152: Y.MX1 128.31,67.84 128.31,65.56 130.06,63.8 D21.A
N$22
  Bottom 0.152: U.MX1 147.36,67.84 147.36,65.56 149.11,63.8 D22.A
N$23
  Bottom 0.152: I.MX1 166.41,67.84 166.41,65.56 168.16,63.8 D23.A
N$24
  Bottom 0.152: O.MX1 185.46,67.84 185.46,65.56 187.21,63.8 D24.A
N$25
  Bottom 0.152: P.MX1 204.51,67.84 204.51,65.56 206.26,63.8 D25.A
N$26
  Bottom 0.152: OPENING_BRACKET.MX1 223.56,67.84 223.56,65.56 225.31,63.8 D26.A
N$27
  Bottom 0.152: CLOSING_BRACKET.MX1 242.61,67.84 242.61,65.56 244.36,63.8 D27.A
N$28
  Bottom 0.152: BACKSLASH.MX1 266.42,67.84 266.42,65.56 268.18,63.8 D28.A
N$29
  Bottom 0.152: CAPS_LOCK.MX1 11.63,48.79 11.63,46.51 13.38,44.75 D29.A
N$30
  Bottom 0.152: A.MX1 37.82,48.79 37.82,46.51 39.58,44.75 D30.A
N$31
  Bottom 0.152: S.MX1 56.87,48.79 56.87,46.51 58.62,44.75 D31.A
N$32
  Bottom 0.152: D.MX1 75.92,48.79 75.92,46.51 77.67,44.75 D32.A
N$33
  Bottom 0.152: F.MX1 94.97,48.79 94.97,46.51 96.73,44.75 D33.A
N$34  (1 unrouted)
N$35
  Bottom 0.152: H.MX1 133.07,48.79 133.07,46.51 134.82,44.75 D35.A
N$36
  Bottom 0.152: J.MX1 152.12,48.79 152.12,46.51 153.88,44.75 D36.A
N$37
  Bottom 0.152: K.MX1 171.17,48.79 171.17,46.51 172.92,44.75 D37.A
N$38
  Bottom 0.152: L.MX1 190.22,48.79 190.22,46.51 191.97,44.75 D38.A
N$39
  Bottom 0.152: SEMICOLON.MX1 209.27,48.79 209.27,46.51 211.02,44.75 D39.A
N$40
  Bottom 0.152: APOSTROPHE.MX1 228.32,48.79 228.32,46.51 230.07,44.75 D40.A
N$41
  Bottom 0.152: ENTER.MX1 259.28,48.79 259.28,46.51 261.03,44.75 D41.A
N$42
  Bottom 0.152: MACRO_2.MX1 290.24,48.79 290.24,46.51 291.99,44.75 D42.A
N$43
  Bottom 0.152: L_SHIFT.MX1 16.39,29.74 16.39,27.46 18.14,25.7 D43.A
N$44
  Bottom 0.152: Z.MX1 47.35,29.74 47.35,27.46 49.1,25.7 D44.A
N$45
  Bottom 0.152: X.MX1 66.4,29.74 66.4,27.46 68.15,25.7 D45.A
N$46
  Bottom 0.152: C.MX1 85.45,29.74 85.45,27.46 87.2,25.7 D46.A
N$47
  Bottom 0.152: V.MX1 104.5,29.74 104.5,27.46 106.25,25.7 D47.A
N$48
  Bottom 0.152: B.MX1 123.55,29.74 123.55,27.46 125.3,25.7 D48.A
N$49
  Bottom 0.152: N.MX1 142.6,29.74 142.6,27.46 144.35,25.7 D49.A
N$50
  Bottom 0.152: M.MX1 161.65,29.74 161.65,27.46 163.4,25.7 D50.A
N$51
  Bottom 0.152: COMMA.MX1 180.7,29.74 180.7,27.46 182.45,25.7 D51.A
N$52
  Bottom 0.152: PERIOD.MX1 199.75,29.74 199.75,27.46 201.5,25.7 D52.A
N$53
  Bottom 0.152: SLASH.MX1 218.8,29.74 218.8,27.46 220.55,25.7 D53.A
N$54
  Bottom 0.152: R_SHIFT.MX1 244.99,29.74 244.99,27.46 246.74,25.7 D54.A
N$55
  Bottom 0.152: UP_ARROW.MX1 271.19,29.74 271.19,27.46 272.94,25.7 D55.A
N$56
  Bottom 0.152: MACRO_3.MX1 290.24,29.74 290.24,27.46 291.99,25.7 D56.A
N$57
  Bottom 0.152: CTRL.MX1 6.87,10.69 6.87,8.41 8.62,6.65 D57.A
N$58
  Bottom 0.152: META.MX1 30.68,10.69 30.68,8.41 32.43,6.65 D58.A
N$59
  Bottom 0.152: L_ALT.MX1 54.49,10.69 54.49,8.41 56.24,6.65 D59.A
N$60
  Bottom 0.152: L_SPACE.MX1 92.59,10.69 92.59,8.41 94.34,6.65 D60.A
N$61
  Bottom 0.152: R_SPACE.MX1 168.79,10.69 168.79,8.41 170.54,6.65 D62.A
N$62
  Bottom 0.152: R_ALT.MX1 206.89,10.69 206.89,8.41 208.64,6.65 D63.A
N$63
  Bottom 0.152: LEFT_ARROW.MX1 252.14,10.69 252.14,8.41 253.89,6.65 D65.A
N$64
  Bottom 0.152: RIGHT_ARROW.MX1 290.24,10.69 290.24,8.41 291.99,6.65 D67.A
N$65
  Bottom 0.152: MACRO_1.MX1 290.24,67.84 290.24,65.56 291.99,63.8 D69.A
N$66
  Bottom 0.152: MACRO_0.MX1 290.24,86.89 290.24,84.61 291.99,82.85 D68.A
N$67
  Bottom 0.152: M_FN.MX1 130.69,10.69 130.69,8.41 132.44,6.65 D61.A
N$68
  Bottom 0.152: DOWN_ARROW.MX1 271.19,10.69 271.19,8.41 272.94,6.65 D66.A
N$69
  Bottom 0.152: R_FN.MX1 230.7,10.69 230.7,8.41 232.46,6.65 D64.A
N$70  (via drill 0.35)
  Top 0.152: v19.95,80.45 v19.95,76.95 | v23.95,61.45 v23.95,57.95 | v28.95,42.45 v28.95,38.95 | v30.45,23.45 v30.45,19.95
  Bottom 0.152: TILDA.MX2 19.95,87.42 v19.95,80.45 | v19.95,76.95 21.85,75.05 TAB.MX2 23.95,69.13 v23.95,61.45 | v23.95,57.95 23.95,52.45 24.23,52.17 CAPS_LOCK.MX2 28.95,47.46 v28.95,42.45 | v28.95,38.95 29,38.9 L_SHIFT.MX2 30.45,31.68 v30.45,23.45 | v30.45,19.95 24.58,14.08 CTRL.MX2
N$71  (via drill 0.35)
  Top 0.152: v38.95,80.45 v38.95,76.95 | v48.45,61.45 v48.45,57.95 | v53.45,42.45 v53.45,38.95 | v62.45,23.45 v62.45,19.95
  Bottom 0.152: ONE.MX2 38.95,87.47 v38.95,80.45 | v38.95,76.95 41.94,76.95 45.67,73.23 Q.MX2 48.45,68.45 v48.45,61.45 | v48.45,57.95 50.43,55.97 A.MX2 53.45,49.16 v53.45,42.45 | v53.45,38.95 55.95,38.95 59.95,34.95 Z.MX2 62.45,30.63 v62.45,23.45 | v62.45,19.95 60.45,17.95 46.45,17.95 43.28,14.78 META.MX2
N$72  (via drill 0.35)
  Top 0.152: v57.95,80.45 v57.95,76.95 | v67.45,61.45 v67.45,57.95 | v72.45,42.45 v72.45,38.95 | v81.45,23.45 v81.45,19.95
  Bottom 0.152: TWO.MX2 57.95,87.52 v57.95,80.45 | v57.95,76.95 61,76.95 64.72,73.23 W.MX2 67.45,68.5 v67.45,61.45 | v67.45,57.95 69.48,55.92 S.MX2 72.45,49.21 v72.45,42.45 | v72.45,38.95 74.95,38.95 79,34.9 X.MX2 81.45,30.68 v81.45,23.45 | v81.45,19.95 75.58,14.08 L_ALT.MX2
N$73  (via drill 0.35)
  Top 0.152: v76.95,80.45 v76.95,76.95 | v86.45,61.45 v86.45,57.95 | v91.45,42.45 v91.45,38.95 | v100.45,23.45 v100.45,19.95
  Bottom 0.152: THREE.MX2 76.95,87.57 v76.95,80.45 | v76.95,76.95 79.95,76.95 83.77,73.14 E.MX2 86.45,68.55 v86.45,61.45 | v86.45,57.95 88.53,55.87 D.MX2 91.45,49.26 v91.45,42.45 | v91.45,38.95 93.95,38.95 98.05,34.85 C.MX2 100.45,30.73 v100.45,23.45 | v100.45,19.95 101.95,19.95 105.2,16.7 L_SPACE.MX2
N$74  (via drill 0.35)
  Top 0.152: v95.95,80.45 v95.95,76.95 | v105.45,61.45 v105.45,57.95 | v110.45,42.45 v110.45,38.95
  Bottom 0.152: FOUR.MX2 95.95,87.62 v95.95,80.45 | v95.95,76.95 98.95,76.95 102.81,73.09 R.MX2 105.45,68.59 v105.45,61.45 | v105.45,57.95 107.58,55.82 F.MX2 110.45,49.31 v110.45,42.45 | v110.45,38.95 112.95,38.95 117.1,34.8 V.MX2
N$75  (via drill 0.35)
  Top 0.152: v114.95,80.45 v114.95,76.95 | v124.45,61.45 v124.45,57.95 | v129.45,42.45 v129.45,38.95 | v138.45,23.45 v138.45,19.95
  Bottom 0.152: FIVE.MX2 114.95,87.67 v114.95,80.45 | v114.95,76.95 117.95,76.95 121.86,73.03 T.MX2 124.45,68.64 v124.45,61.45 | v124.45,57.95 126.63,55.77 G.MX2 129.45,49.36 v129.45,42.45 | v129.45,38.95 131.95,38.95 136.15,34.75 B.MX2 138.45,30.83 v138.45,23.45 | v138.45,19.95 139.95,19.95 143.3,16.6 M_FN.MX2
N$76  (via drill 0.35)
  Top 0.152: v133.95,80.45 v133.95,76.95 | v143.45,61.45 v143.45,57.95 | v148.45,42.45 v148.45,38.95
  Bottom 0.152: SIX.MX2 133.95,87.72 v133.95,80.45 | v133.95,76.95 136.95,76.95 140.91,72.98 Y.MX2 143.45,68.7 v143.45,61.45 | v143.45,57.95 145.68,55.72 H.MX2 148.45,49.41 v148.45,42.45 | v148.45,38.95 150.95,38.95 155.2,34.7 N.MX2
N$77  (via drill 0.35)
  Top 0.152: v152.95,80.45 v152.95,76.95 | v162.45,61.45 v162.45,57.95 | v167.45,42.45 v167.45,38.95 | v176.45,23.45 v176.45,19.95
  Bottom 0.152: SEVEN.MX2 152.95,87.77 v152.95,80.45 | v152.95,76.95 155.95,76.95 159.96,72.94 U.MX2 162.45,68.75 v162.45,61.45 | v162.45,57.95 164.73,55.67 J.MX2 167.45,49.46 v167.45,42.45 | v167.45,38.95 169.95,38.95 174.25,34.65 M.MX2 176.45,30.93 v176.45,23.45 | v176.45,19.95 177.95,19.95 181.4,16.5 R_SPACE.MX2
N$78  (via drill 0.35)
  Top 0.152: v171.95,80.45 v171.95,76.95 | v181.45,61.45 v181.45,57.95 | v186.45,42.45 v186.45,38.95
  Bottom 0.152: EIGHT.MX2 171.95,87.82 v171.95,80.45 | v171.95,76.95 174.95,76.95 179.01,72.89 I.MX2 181.45,68.8 v181.45,61.45 | v181.45,57.95 183.78,55.62 K.MX2 186.45,49.51 v186.45,42.45 | v186.45,38.95 188.95,38.95 193.3,34.6 COMMA.MX2
N$79  (via drill 0.35)
  Top 0.152: v190.95,80.45 v190.95,76.95 | v200.45,61.45 v200.45,57.95 | v205.45,42.45 v205.45,38.95 | v214.45,23.45 v214.45,19.95
  Bottom 0.152: NINE.MX2 190.95,87.87 v190.95,80.45 | v190.95,76.95 193.95,76.95 198.06,72.84 O.MX2 200.45,68.84 v200.45,61.45 | v200.45,57.95 202.83,55.57 L.MX2 205.45,49.56 v205.45,42.45 | v205.45,38.95 207.95,38.95 212.35,34.55 PERIOD.MX2 214.45,31.03 v214.45,23.45 | v214.45,19.95 215.95,19.95 219.5,16.4 R_ALT.MX2
N$80  (via drill 0.35)
  Top 0.152: v228.95,80.45 v228.95,76.95 | v238.45,61.45 v238.45,57.95 | v243.45,42.45 v243.45,38.95 | v259.95,23.45 v259.95,19.95
  Bottom 0.152: MINUS.MX2 228.95,87.97 v228.95,80.45 | v228.95,76.95 231.95,76.95 236.16,72.73 OPENING_BRACKET.MX2 238.45,68.95 v238.45,61.45 | v238.45,57.95 240.93,55.47 APOSTROPHE.MX2 243.45,49.66 v243.45,42.45 | v243.45,38.95 246.45,35.95 255.95,35.95 257.6,34.3 R_SHIFT.MX2 259.95,30.78 v259.95,23.45 | v259.95,19.95 261.45,19.95 264.74,16.66 LEFT_ARROW.MX2
N$81  (via drill 0.35)
  Top 0.152: v209.95,80.45 v209.95,76.95 | v219.45,61.45 v219.45,57.95 | v224.45,42.45 v224.45,38.95 | v233.45,23.45 v233.45,19.95
  Bottom 0.152: ZERO.MX2 209.95,87.92 v209.95,80.45 | v209.95,76.95 212.95,76.95 217.11,72.78 P.MX2 219.45,68.89 v219.45,61.45 | v219.45,57.95 221.88,55.52 SEMICOLON.MX2 224.45,49.61 v224.45,42.45 | v224.45,38.95 226.95,38.95 231.4,34.5 SLASH.MX2 233.45,31.08 v233.45,23.45 | R_FN.MX2 243.31,16.09 239.45,19.95 v233.45,19.95
N$82  (via drill 0.35)
  Top 0.152: v247.95,80.45 v247.95,76.95 | v259.95,61.45 v259.95,57.95 | v273.45,42.45 v273.45,38.95 | v285.95,23.45 v285.95,19.95
  Bottom 0.152: PLUS.MX2 247.95,88.02 v247.95,80.45 | v247.95,76.95 250.95,76.95 255.21,72.69 CLOSING_BRACKET.MX2 259.95,66.5 v259.95,61.45 | v259.95,57.95 261.95,55.95 269.95,55.95 271.95,53.95 271.95,52.25 ENTER.MX2 273.45,50.61 v273.45,42.45 | v273.45,38.95 273.45,36.95 274.45,35.95 282.45,35.95 283.79,34.61 UP_ARROW.MX2 285.95,30.97 v285.95,23.45 | v285.95,19.95 285.95,16.24 DOWN_ARROW.MX2
N$83  (via drill 0.35)
  Top 0.152: v275.95,80.45 v275.95,76.95 | v284.95,61.45 v284.95,38.95
  Bottom 0.152: BACKSPACE.MX2 275.95,88.59 v275.95,80.45 | v275.95,76.95 275.95,76.45 279.03,73.37 BACKSLASH.MX2 284.95,65.31 v284.95,61.45 | v284.95,38.95 287.45,38.95 289.45,36.95 300.95,36.95 302.95,34.95 302.95,33.24 MACRO_3.MX2 303.34,32.63 303.34,14.58 RIGHT_ARROW.MX2
N$84
  Bottom 0.152: MACRO_0.MX2 303.26,89.86 303.26,71.65 MACRO_1.MX2 303.26,70.81 303.26,52.6 MACRO_2.MX2
N$85  (1 unrouted)
N$86  (3 unrouted)
N$87  (2 unrouted)
N$88  (2 unrouted)
N$89  (1 unrouted)
N$90  (1 unrouted)
N$91  (1 unrouted)
N$92  (1 unrouted)
N$93  (1 unrouted)
N$94  (1 unrouted)
N$95  (1 unrouted)
N$96  (4 unrouted)
N$97  (1 unrouted)
N$98  (4 unrouted)
N$99  (1 unrouted)
N$100  (4 unrouted)
ROW0
  Bottom 0.152: D1.C D2.C D3.C D4.C D5.C D6.C D7.C D8.C D9.C D10.C D11.C D12.C D13.C 254.46,78.8 255.2,79.54 257.35,79.54 258.09,78.8 D14.C 278.26,78.8 279,79.54 281.15,79.54 281.89,78.8 D68.C
ROW1
  Bottom 0.152: D15.C D16.C D17.C D18.C D19.C D20.C D21.C D22.C D23.C D24.C D25.C D26.C D27.C D28.C D69.C
ROW2
  Bottom 0.152: D29.C D30.C D31.C D32.C D33.C D34.C D35.C D36.C D37.C D38.C D39.C D40.C 252.08,40.7 252.82,41.44 254.96,41.44 255.7,40.7 D41.C 275.88,40.7 276.62,41.44 278.76,41.44 279.5,40.7 D42.C
ROW3  (1 unrouted)
  Bottom 0.152: D43.C 32.99,21.65 33.74,22.39 35.88,22.39 36.62,21.65 D44.C D45.C 87.25,21.65 87.45,21.45 | D46.C D47.C D48.C D49.C D50.C D51.C D52.C D53.C D54.C D55.C D56.C
ROW4
  Bottom 0.152: D57.C D58.C D59.C 84.83,2.6 86.33,4.11 88.08,4.11 89.59,2.6 D60.C 108.63,2.6 110.13,4.11 111.88,4.11 113.39,2.6 D61.C 161.03,2.6 162.53,4.11 164.28,4.11 165.79,2.6 D62.C 184.83,2.6 186.33,4.11 188.08,4.11 189.59,2.6 D63.C D64.C D65.C D66.C D67.C
VBUS  (8 unrouted)
VCC  (11 unrouted)